# Altium schematic sheet Title Sheet.SchDoc
size B; Author: AM; CompanyName: Expatria Technologies; DrawnBy: A.Marles; Engineer: AM; Organization: Expatria Technologies; Address1: Schematic; Address2: 101 Main Street, 14th Floor; Address3: Cambridge, MA 02142; Address4: USA; DocumentNumber: 1; SheetNumber: 1; SheetTotal: 14; PCB_Rev: A1
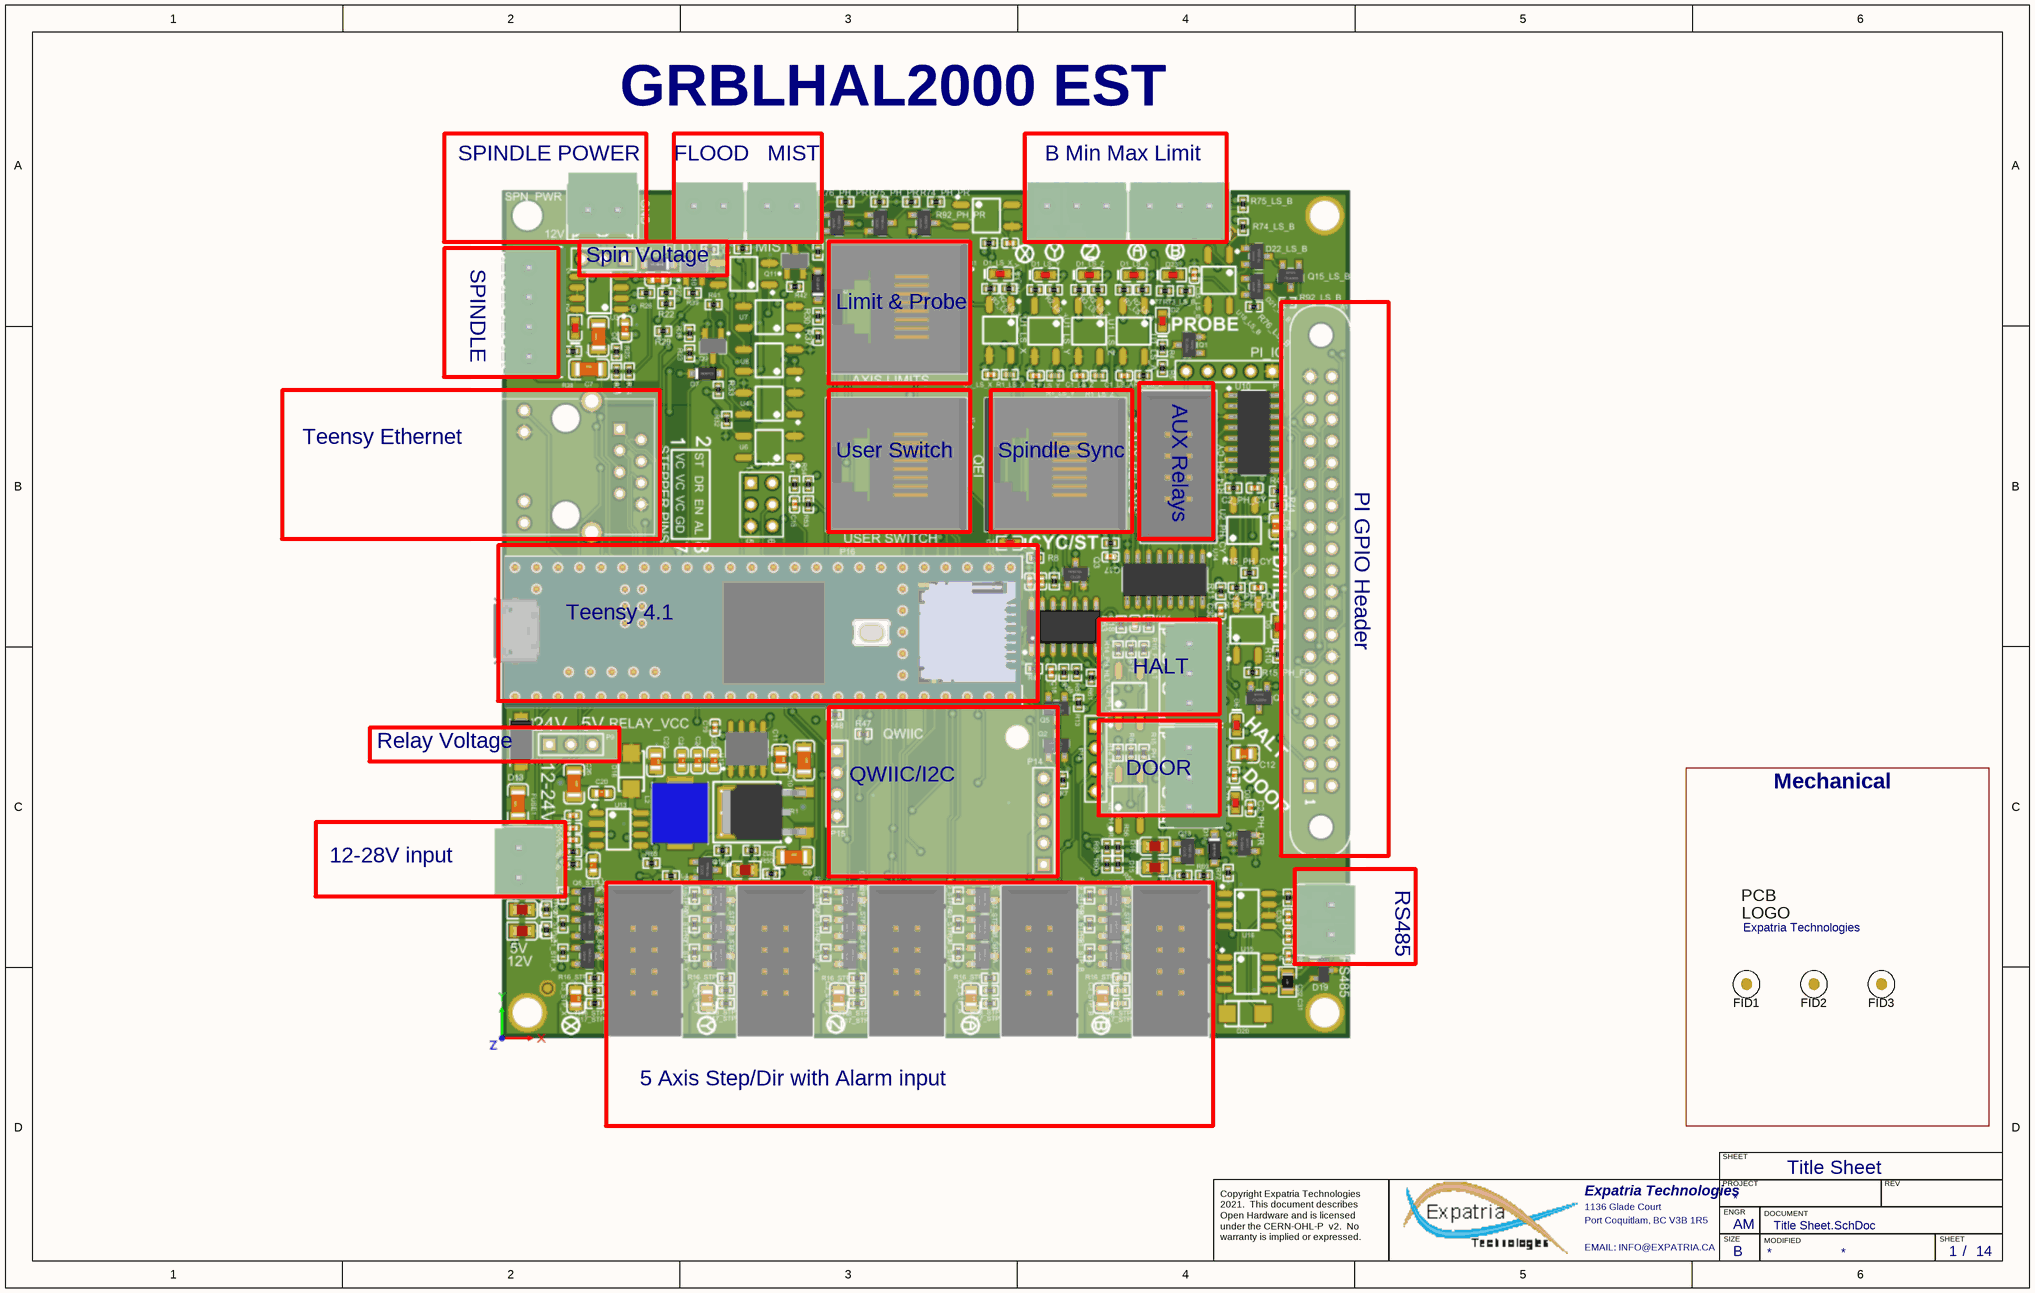
[diagram p0: Title Sheet.SchDoc]

## Parts
FID1  (no value)  [Fiducial10-20]  (no BOM)
FID2  Fiducial  [Fiducial10-20]  (value not drawn)  (no BOM)
FID3  Fiducial  [Fiducial10-20]  (value not drawn)  (no BOM)
Logo1  Expatria Technologies  [Expatria-Logo]  (no BOM)

## Blocks framed on the sheet
Mechanical: FID1-FID3 Logo1

## Notes on the sheet
- SPINDLE POWER
- GRBLHAL2000 EST
- FLOOD   MIST
- B Min Max Limit
- SPINDLE
- Spin Voltage
- Limit & Probe
- AUX Relays
- Teensy Ethernet
- User Switch
- Spindle Sync
- PI GPIO Header
- Teensy 4.1
- HALT
- Relay Voltage
- DOOR
- QWIIC/I2C
- 12-28V input
- RS485
- 5 Axis Step/Dir with Alarm input
- Title Sheet
- SHEET
- Expatria Technologies
- 1136 Glade Court
- Port Coquitlam, BC V3B 1R5
- PROJECT
- SIZE
- ENGR
- MODIFIED
- DOCUMENT
- REV
- Copyright Expatria Technologies 2021.  This document describes Open Hardware and is licensed under the CERN-OHL-P  v2.  No warranty is implied or expressed.
- EMAIL: INFO@EXPATRIA.CA
- B
- /
- (in symbol SBT-Logo) PCB; LOGO

## Library data of the parts
FID1-FID3 = Fiducial: FIDUCIAL NO ASSEMBLY; Manufacturer 1: NONE; Manufacturer Part Number 1: NONE; Value: Fiducial
Logo1 = SBT-Logo: Manufacturer 1: NONE; Value: Expatria Logo; Manufacturer Part Number 1: NONE